# Altium schematic sheet amplifier-chain.SchDoc: AMPLIFIER-OPTICAL
size A4; DrawnBy: Dylan Vogel; Organization: UTAT SS; DocumentNumber: 7; Revision: 1; SheetNumber: 7; SheetTotal: 7
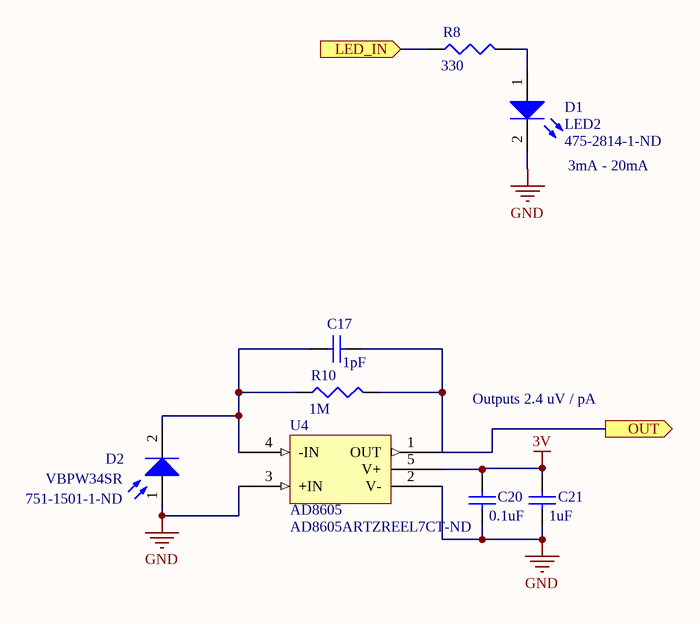
[diagram p0: amplifier-chain.SchDoc]

## Parts
C17  1pF  [0402]
C20  0.1uF  [0402]
C21  1uF  [1608[0603]]
D1  LED2  Supplier Part Number: 475-2814-1-ND  [LB P4SG]
D2  VBPW34SR  Supplier Part Number: 751-1501-1-ND  [VBPW34SR]
R8  330  [0402]
R10  1M  [J1-0603]
U4  AD8605  Supplier Part Number 1: AD8605ARTZREEL7CT-ND  [SOP-65P200X125-5N]

## Ports
LED_IN (in), OUT (out)

## Nets
3V: C20.2 C21.2 U4.5(V+)
GND: C20.1 C21.1 D1.2(K) D2.1(A) U4.2(V-) U4.3(+IN)
LED_IN: R8.1 ; port LED_IN
OUT: C17.2 R10.2 U4.1(OUT) ; port OUT
NetC17_1: C17.1 D2.2(K) R10.1 U4.4(-IN)
NetD1_1: D1.1(A) R8.2

## Notes on the sheet
- (near D1) 3mA - 20mA
- Outputs 2.4 uV / pA

## Library data of the parts
C17 C20 C21 = Cap Semi: Capacitor (Semiconductor SIM Model); Published: 8-Jun-2000; LatestRevisionDate: 29-May-2009; LatestRevisionNote: IPC-7351 Footprint Added.; PackageReference: C1206; Publisher: Altium Limited; PackageDescription: Chip Capacitor; Supplier: Digi-Key
  C17: Value: 1pF
  C20: Value: 0.1uF
  C21: Value: 1uF
D1 = LED2: Typical RED, GREEN, YELLOW, AMBER GaAs LED; Published: 8-Jun-2000; LatestRevisionDate: 17-Jul-2002; LatestRevisionNote: Re-released for DXP Platform.; PackageVersion: Feb-2002; PackageReference: 3.2X1.6X1.1; Publisher: Altium Limited; PackageDescription: SM LED; 2 Flat Leads; Supplier: Digi-Key
D2 = Photo Sen: Photosensitive Diode; Published: 24-Mar-1999; LatestRevisionDate: 17-Jul-2002; LatestRevisionNote: Re-released for DXP Platform.; PackageReference: PIN2; Publisher: Altium Limited; Supplier: Digi-Key
R8 R10 = Res3: Resistor; Published: 8-Jun-2000; LatestRevisionDate: 29-May-2009; LatestRevisionNote: IPC-7351 Footprint Added.; PackageReference: J1-0603; Publisher: Altium Limited; PackageDescription: Chip Resistor; Supplier: Digi-Key
  R8: Value: 330
  R10: Value: 1M
U4 = AD8605: Low noise, precision rail-to-rail op-amp.; Supplier 1: Digi-Key; Supplier: Digi-Key